# Altium schematic sheet [04] - MECHANICAL.SchDoc
size A4; DocumentNumber: 4; SheetNumber: 4; SheetTotal: 6
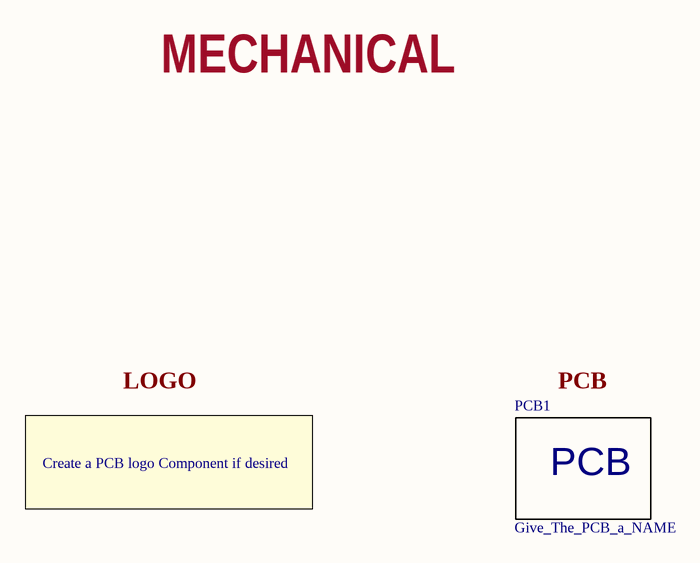
[diagram p0: [04] - MECHANICAL.SchDoc]

## Parts
PCB1  Give_The_PCB_a_NAME

## Notes on the sheet
- MECHANICAL
- LOGO
- PCB
- Create a PCB logo Component if desired
- Project:
- Revision:
- Engineer:
- Title:
- Page
- of
- Embedded Things
- Date:
- Hour:
- Variant:

## Library data of the parts
PCB1 = PCB: Printed Circuit Board; Category: Printed Circuit Board